# EAGLE design Reverse_current (EAGLE 6.4)
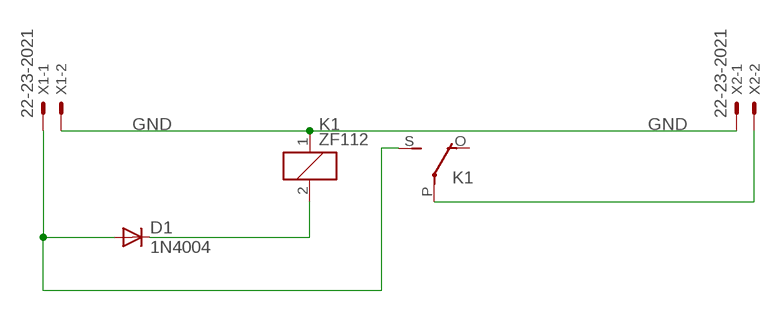
[diagram p0: schematic, sheet 1]

## Parts
D1  1N4004  [DO41-10]
K1  ZF112  [ZF112]
X1  22-23-2021  [22-23-2021]
X2  22-23-2021  [22-23-2021]

## Nets
GND [GND]: K1.1 X1.2 X2.1
N$2: D1.A K1.S(2:S) X1.1
N$3: D1.C K1.2
N$5: K1.P(2:P) X2.2
Unconnected: K1.O(2:O)

## Library data of the parts
D1 = diode:1N4004: DIODE general purpose rectifier, 1 A
K1 = relay:ZF112: RELAY 1 x switch; OC_FARNELL: unknown; OC_NEWARK: unknown
X1 X2 = con-molex:22-23-2021: .100" (2.54mm) Center Header - 2 Pin; MF: MOLEX; MPN: 22-23-2021; OC_FARNELL: 1462926; OC_NEWARK: 25C3832

## Net classes
1 GND: width 0.559 mm, drill 0.559 mm, clearance 0.559 mm

## Board
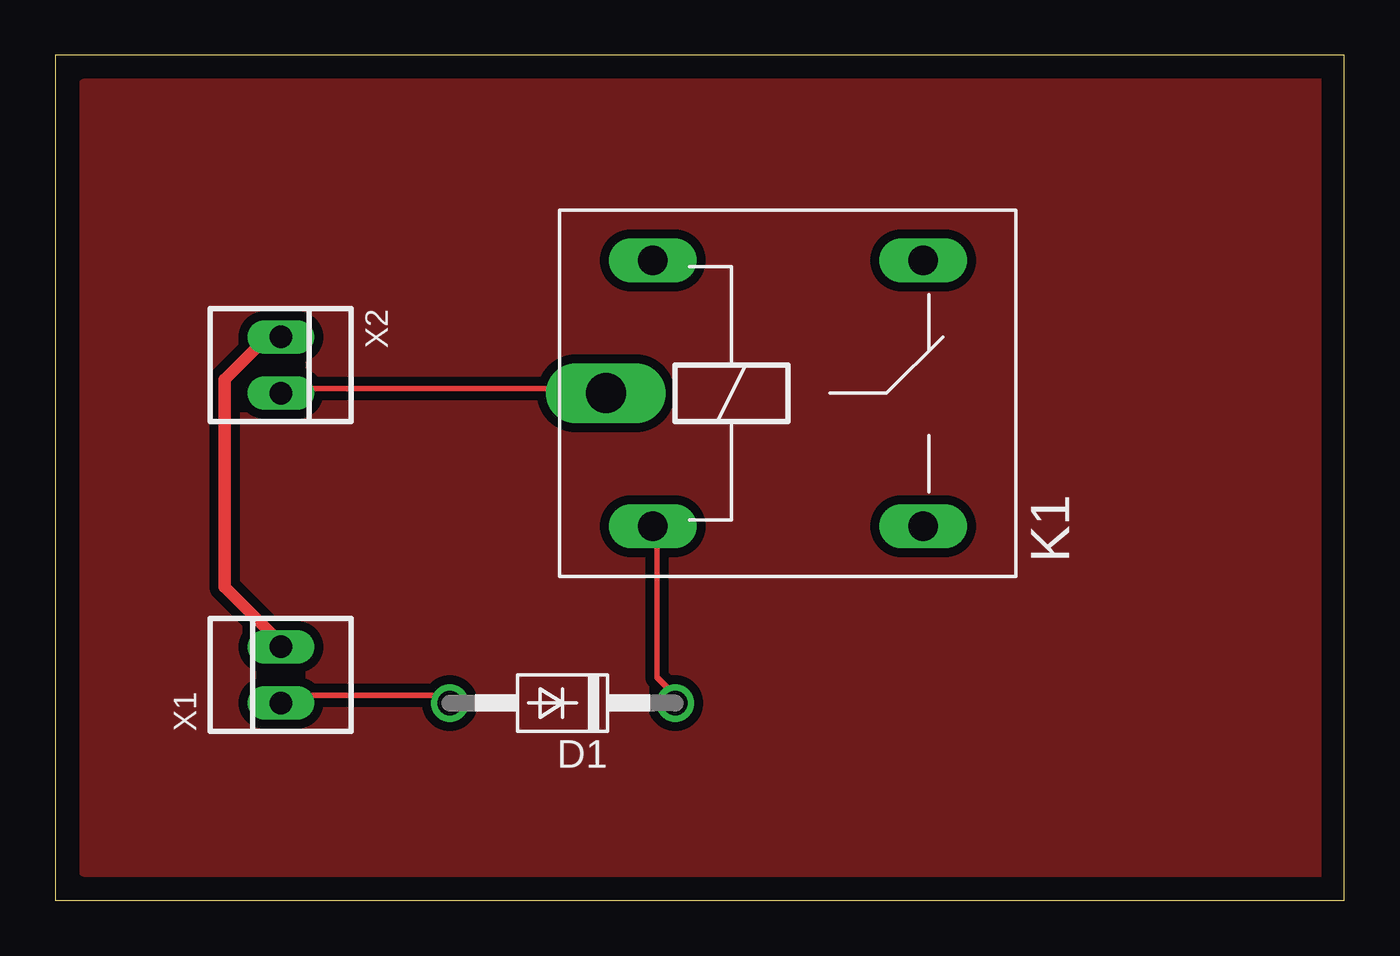
[diagram p1: board, top side]
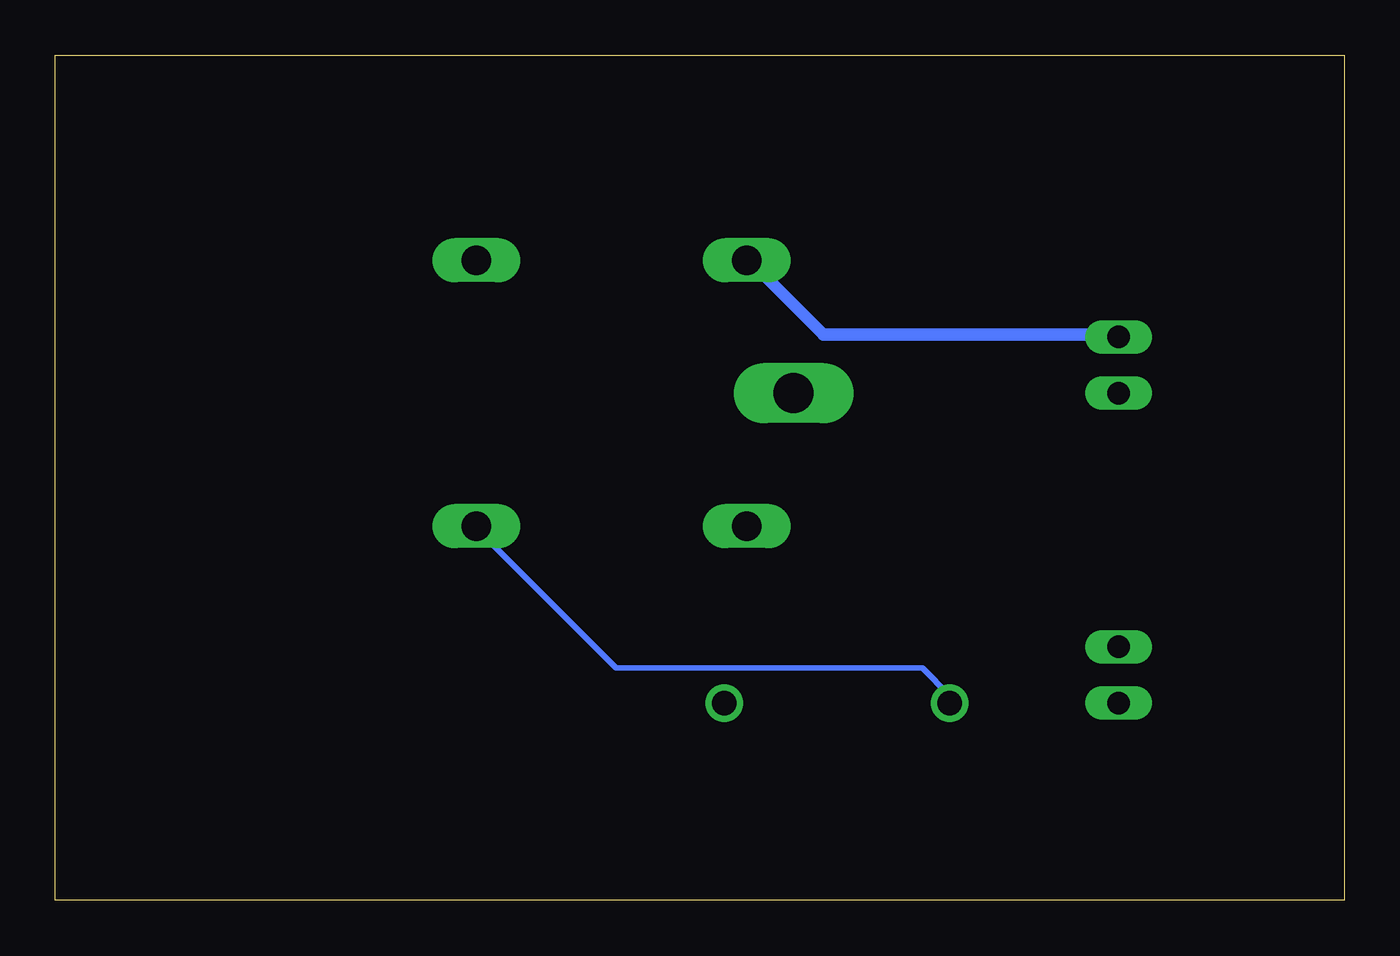
[diagram p2: board, bottom side, seen from below]

Size 58.09 x 38.09 mm. Coordinates in mm from the lower left corner, seen from the top.
Outline: 0,0 58.09,0 58.09,38.09 0,38.09 0,0
Copper layers (1*16): Top 0.035mm / dielectric 1.5mm / Bottom 0.035mm
Design rules "default *": minimum track width 10mil, minimum drill 24mil, track to track 16mil, track to pad 16mil, pad to pad 16mil, via to via 16mil, smd to smd 8mil, copper to edge 40mil, drill to drill 8mil, minimum pad ring 10mil, minimum via ring 8mil, stop-mask expansion 4mil, vias tented up to drill 0mil, thermal gap 10mil

### Footprints (pad centres in the part's own frame; a part is rotated, then mirrored left to right if it is on the bottom)
DO41-10 = drill 1.118: A 5.08,0; C -5.08,0
ZF112 = drill 1.321 long: 1 -6.096,5.994; 2 -6.096,-5.994; O 6.096,5.994; S 6.096,-5.994 | drill 1.803 long: P -8.204,0
22-23-2021 = drill 1 long: 1 -1.27,0; 2 1.27,0

### Placement (x,y rotation side)
D1  22.86,8.89 180 top
K1  33.02,22.86 0 top
X1  10.16,10.16 90 top
X2  10.16,24.13 270 top

### Tracks (layer width: path | path; a pad name or v marks a point on that pad's centre or on a via)
GND
  Top 0.559: X1.2 10.06,11.68 7.62,14.12 7.62,23.47 9.25,25.1 10.06,25.1 X2.1
  Bottom 0.559: K1.1 26.72,28.75 23.47,25.5 10.46,25.5 X2.1
N$1
  pour Top: 1.27,1.27 55.88,1.27 57.15,1.27 57.15,36.83 1.27,36.83
N$2
  Top 0.254: X1.1 10.46,9.25 17.78,9.25 D1.A
  Bottom 0.254: K1.S 38.91,16.56 32.82,10.46 19,10.46 17.78,9.25 D1.A
N$3
  Top 0.254: D1.C 27.94,9.25 27.13,10.06 27.13,16.56 K1.2
N$5
  Top 0.254: X2.2 10.46,23.06 24.69,23.06 K1.P